# EAGLE design ThermoEagle (EAGLE 9.3.1)
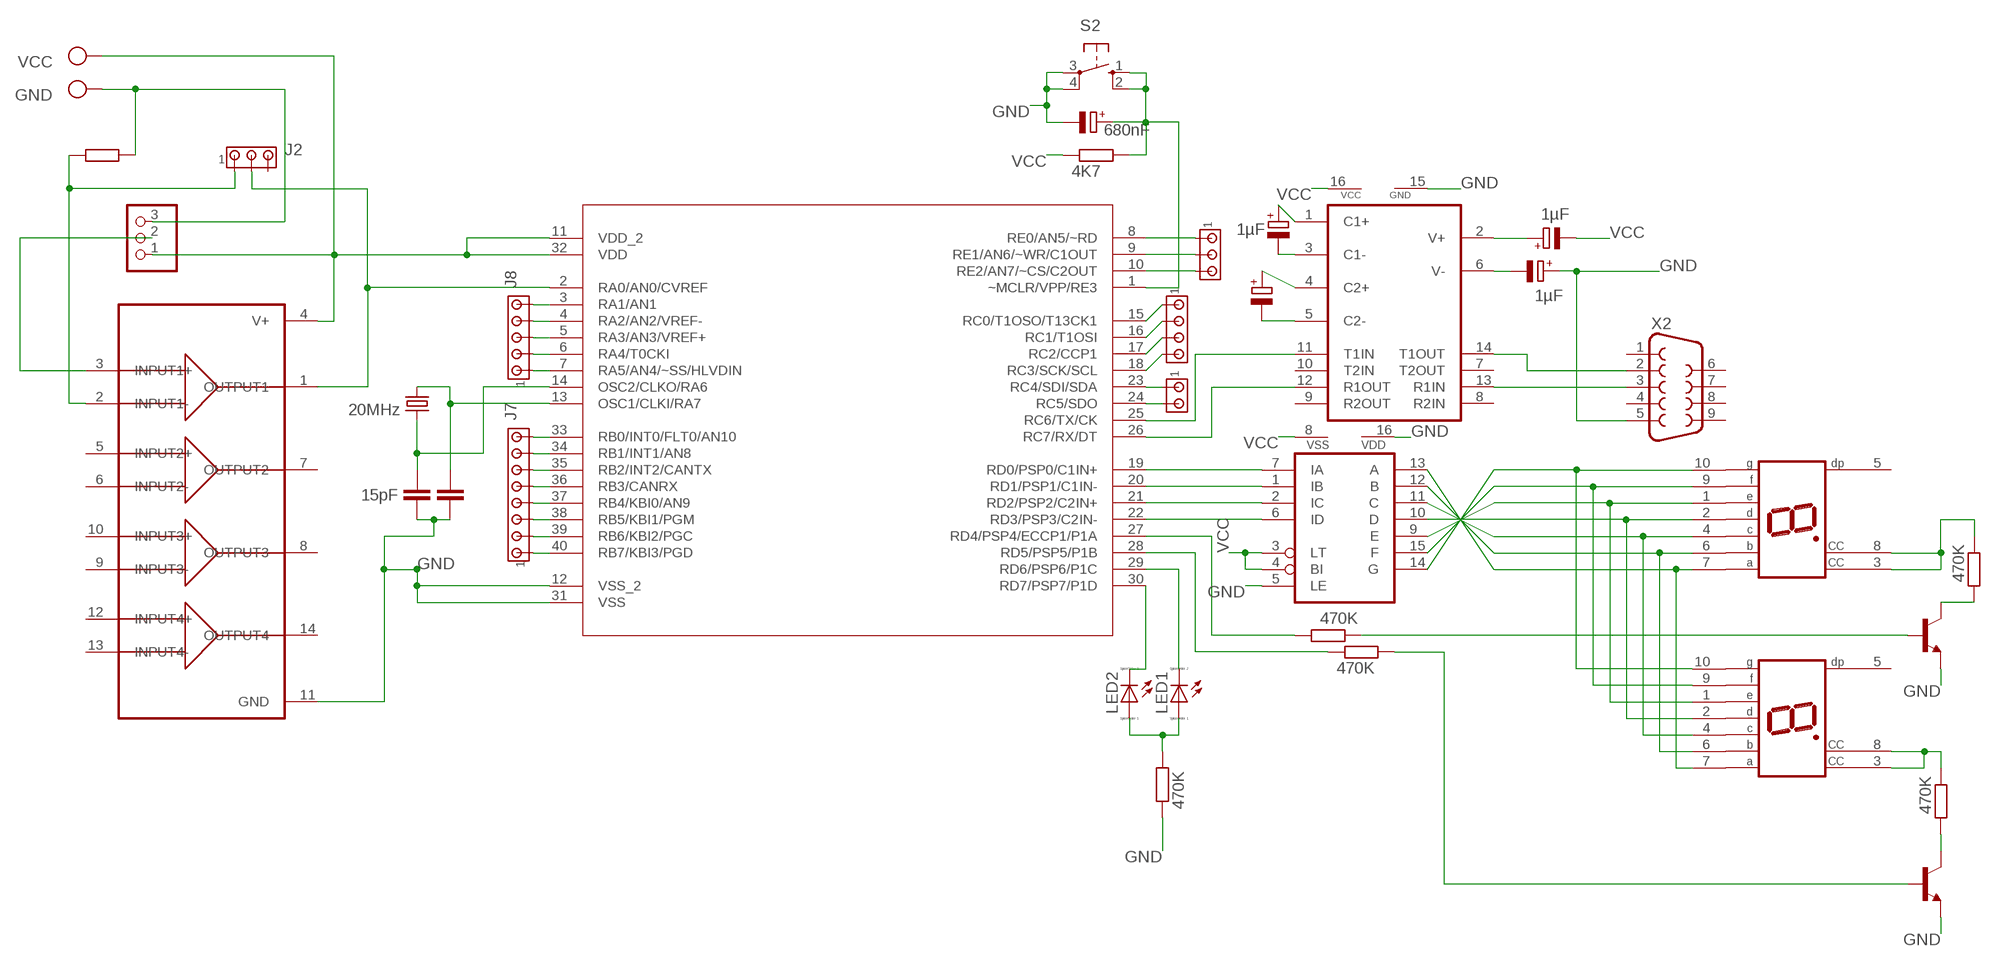
[diagram p0: schematic, sheet 1]

## Parts
C1  1µF  CPOL-EUB45181B  [B45181B]
C2  1µF  CPOL-EUB45181B  [B45181B]
C3  1µF  CPOL-EUB45181B  [B45181B]
C5  1µF  CPOL-EUB45181B  [B45181B]
C6  15pF  C-EU050-025X075  [C050-025X075]
C7  C-EU050-025X075  [C050-025X075]
C8  680nF  CPOL-EUB45181C  [B45181C]
DIS1  HD-H103  [HDSP-M]
DIS2  HD-H103  [HDSP-M]
IC1  MAX232  [DIL16]
IC2  4511N  [DIL16]
J1  MTA04-100  [10X04MTA]
J2  MTA03-100  [10X03MTA]
J3  MTA02-100  [10X02MTA]
J4  MTA03-100  [10X03MTA]
J7  MTA08-100  [10X08MTA]
J8  MTA05-100  [10X05MTA]
JP1  PINHD-1X3  [1X03]
LED1  LED_ELD260  [LED_LD260]
LED2  LED_ELD260  [LED_LD260]
Q1  20MHz  CRYSTALHC18U-V  [HC18U-V]
R1  470K  R-EU_0207/7  [0207/7]
R2  470K  R-EU_0207/7  [0207/7]
R3  470K  R-EU_0207/7  [0207/7]
R10  470K  R-EU_0207/7  [0207/7]
R11  470K  R-EU_0207/7  [0207/7]
R13  R-EU_0207/7  [0207/7]
R14  4K7  R-EU_0207/7  [0207/7]
S2  10-XX  [B3F-10XX]
T1  2N2219  [TO5]
T2  2N2219  [TO5]
U1  LM324  [DIP790W51P254L1994H508Q14]
U$1  PIC18F4585-I/P  [DIP254P1524X635-40]
X1  AK300/2  [AK300/2]
X2  F09VB  [F09VB]

## Nets
GND: C3.+ C6.2 C7.2 C8.- IC1.15(GND) IC2.5(LE) IC2.16(VDD) JP1.3 R1.1 R13.1 S2.3(P) S2.4(P1) T1.1(E) T2.1(E) U1.11(GND) U$1.12(VSS_2) U$1.31(VSS) X1.2 X2.5
N$1: IC2.7(IA) U$1.19(RD0/PSP0/C1IN+)
N$2: IC1.14(T1OUT) X2.2
N$3: R11.2 T1.2(B)
N$4: R10.2 T2.2(B)
N$6: IC2.1(IB) U$1.20(RD1/PSP1/C1IN-)
N$7: DIS1.3(CC) DIS1.8(CC) R3.1
N$9: R2.2 T1.3(C)
N$10: DIS1.9(F) DIS2.9(F) IC2.15(F)
N$11: IC2.2(IC) U$1.21(RD2/PSP2/C2IN+)
N$12: DIS2.3(CC) DIS2.8(CC) R2.1
N$13: C1.+ IC1.1(C1+)
N$14: C1.- IC1.3(C1-)
N$15: C5.+ IC1.4(C2+)
N$16: C5.- IC1.5(C2-)
N$17: C2.+ IC1.2(V+)
N$19: C3.- IC1.6(V-)
N$21: IC1.13(R1IN) X2.3
N$22: IC2.6(ID) U$1.22(RD3/PSP3/C2IN-)
N$23: LED1.A LED2.A R1.2
N$24: DIS1.1(E) DIS2.1(E) IC2.9(E)
N$25: DIS1.2(D) DIS2.2(D) IC2.10(D)
N$26: DIS1.4(C) DIS2.4(C) IC2.11(C)
N$27: DIS1.6(B) DIS2.6(B) IC2.12(B)
N$28: DIS1.7(A) DIS2.7(A) IC2.13(A)
N$30: R3.2 T2.3(C)
N$31: J2.1 R13.2 U1.2(INPUT1-)
N$32: J8.5 U$1.3(RA1/AN1)
N$33: J8.4 U$1.4(RA2/AN2/VREF-)
N$34: J8.3 U$1.5(RA3/AN3/VREF+)
N$35: J8.2 U$1.6(RA4/T0CKI)
N$36: DIS1.10(G) DIS2.10(G) IC2.14(G)
N$37: LED2.K(C) U$1.30(RD7/PSP7/P1D)
N$38: R10.1 U$1.27(RD4/PSP4/ECCP1/P1A)
N$41: IC1.11(T1IN) U$1.25(RC6/TX/CK)
N$44: R11.1 U$1.28(RD5/PSP5/P1B)
N$45: LED1.K(C) U$1.29(RD6/PSP6/P1C)
N$47: J8.1 U$1.7(RA5/AN4/~SS/HLVDIN)
N$48: JP1.2 U1.3(INPUT1+)
N$49: J2.2 U1.1(OUTPUT1) U$1.2(RA0/AN0/CVREF)
N$50: J7.8 U$1.33(RB0/INT0/FLT0/AN10)
N$51: J7.7 U$1.34(RB1/INT1/AN8)
N$52: C6.1 Q1.1 U$1.14(OSC2/CLKO/RA6)
N$53: C7.1 Q1.2 U$1.13(OSC1/CLKI/RA7)
N$54: J7.6 U$1.35(RB2/INT2/CANTX)
N$58: J7.5 U$1.36(RB3/CANRX)
N$59: J7.4 U$1.37(RB4/KBI0/AN9)
N$60: J7.3 U$1.38(RB5/KBI1/PGM)
N$61: J7.2 U$1.39(RB6/KBI2/PGC)
N$62: J7.1 U$1.40(RB7/KBI3/PGD)
N$63: J4.1 U$1.8(RE0/AN5/~RD)
N$64: J4.2 U$1.9(RE1/AN6/~WR/C1OUT)
N$65: J4.3 U$1.10(RE2/AN7/~CS/C2OUT)
N$66: J1.1 U$1.15(RC0/T1OSO/T13CK1)
N$67: J1.2 U$1.16(RC1/T1OSI)
N$68: J1.3 U$1.17(RC2/CCP1)
N$69: J1.4 U$1.18(RC3/SCK/SCL)
N$70: J3.1 U$1.23(RC4/SDI/SDA)
N$71: J3.2 U$1.24(RC5/SDO)
N$72: C8.+ R14.2 S2.1(S) S2.2(S1) U$1.1(~MCLR/VPP/RE3)
RX: IC1.12(R1OUT) U$1.26(RC7/RX/DT)
VCC: C2.- IC1.16(VCC) IC2.3(LT) IC2.4(BI) IC2.8(VSS) JP1.1 R14.1 U1.4(V+) U$1.11(VDD_2) U$1.32(VDD) X1.1
Unconnected: DIS1.5(DP) DIS2.5(DP) IC1.7(T2OUT) IC1.8(R2IN) IC1.9(R2OUT) IC1.10(T2IN) J2.3 U1.5(INPUT2+) U1.6(INPUT2-) U1.7(OUTPUT2) U1.8(OUTPUT3) U1.9(INPUT3-) U1.10(INPUT3+) U1.12(INPUT4+) U1.13(INPUT4-) U1.14(OUTPUT4) X2.1 X2.4 X2.6 X2.7 X2.8 X2.9

## Library data of the parts
C1-C3 C5 C8 = rcl:CPOL-EU: POLARIZED CAPACITOR, European symbol; SPICEPREFIX: C
C6 C7 = rcl:C-EU: CAPACITOR, European symbol; SPICEPREFIX: C
DIS1 DIS2 = display-hp:HD-H103: LED DISPLAY 1-character 7 segment, decimal point right; OC_FARNELL: unknown; OC_NEWARK: unknown
IC1 = maxim:MAX232: RS232 TRANSCEIVER; MF: MAXIM; MPN: MAX232ACPE+; OC_FARNELL: 9723773; OC_NEWARK: 68K4544
IC2 = 45xx:4511: BCD to 7-segment LATCH/DECODER/DRIVER
J1 = con-amp:MTA04-100: AMP connector
J2 J4 = con-amp:MTA03-100: AMP connector
J3 = con-amp:MTA02-100: AMP connector
J7 = con-amp:MTA08-100: AMP connector
J8 = con-amp:MTA05-100: AMP connector
JP1 = adafruit:PINHD-1X3: PIN HEADER
LED1 LED2 = eagle-ltspice:LED_E: LED Source: http://www.osram.convergy.de Source: www.luxeon.com Source: www.kingbright.com; SPICEMODEL: NONE; SPICEPREFIX: D; SPICETYPE: diode
Q1 = crystal:CRYSTAL: CRYSTAL; OC_FARNELL: unknown; OC_NEWARK: unknown
R1-R3 R10 R11 R13 R14 = resistor:R-EU_: RESISTOR, European symbol
S2 = DC_LOAD_AU:10-XX: OMRON SWITCH; MPN: B3F-1000; OC_FARNELL: 176432; OC_NEWARK: 36M3542
T1 T2 = transistor:2N2219: NPN TRANSISTOR
U1 = LM324:LM324: these devices consist of four independent high-gain frequency-compensated operational amplifiers that are designed sp...; AVAILABILITY: Unavailable; DESCRIPTION: these devices consist of four independent high-gain frequency-compensated operational amplifiers that are designed sp...; MF: STMicroelectronics; MP: LM324; PACKAGE: SOIC-14 Texas Instruments; PRICE: None
U$1 = PIC18F4585-I_P:PIC18F4585-I/P: Enhanced Flash Microcontrollers; DESCRIPTION: PIC18F4585-I/P, 8bit PIC Microcontroller, 40MHz, 48kb, 1024 B Flash, 40-Pin PDIP; DIGI-KEY_PART_NUMBER: PIC18F4585-I/P-ND; DIGI-KEY_PURCHASE_URL: https://www.digikey.com/product-detail/en/microchip-technology/PIC18F4585-I-P/PIC18F4585-I-P-ND/613250?utm_source=snapeda&utm_medium=aggregator&utm_campaign=symbol; MF: Microchip; MP: PIC18F4585-I/P; PACKAGE: DIP-40 Microchip
X1 = con-ptr500:AK300/2: CONNECTOR; OC_FARNELL: unknown; OC_NEWARK: unknown
X2 = con-subd:F09: SUB-D; OC_FARNELL: unknown; OC_NEWARK: unknown

## Board
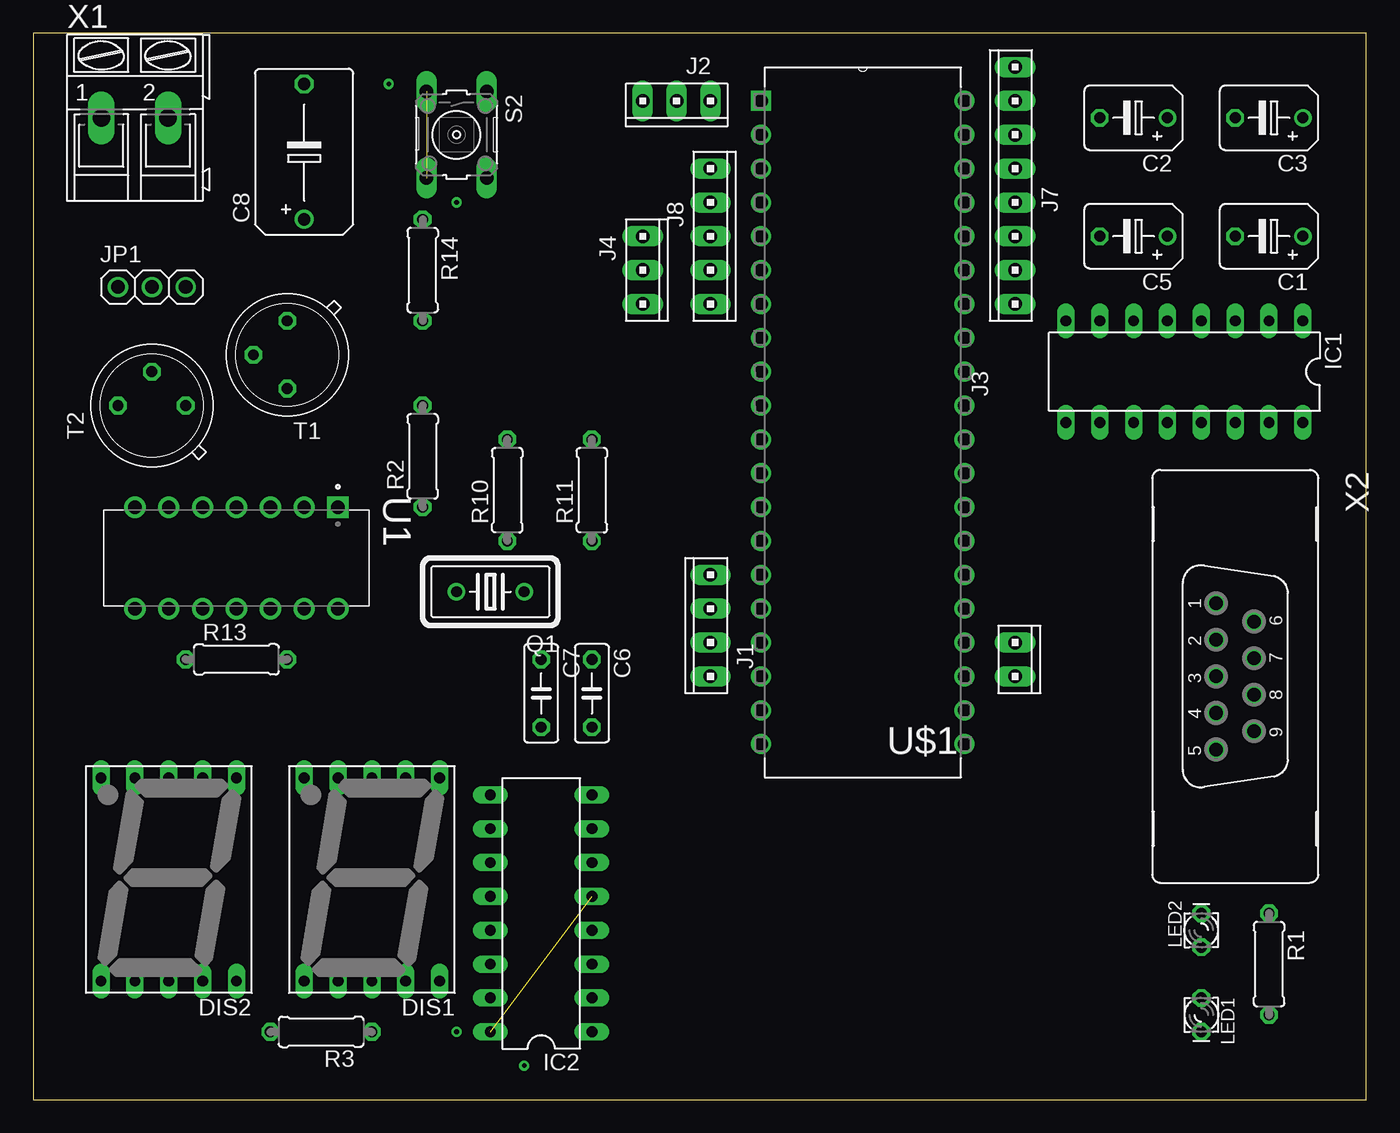
[diagram p1: board, top side]
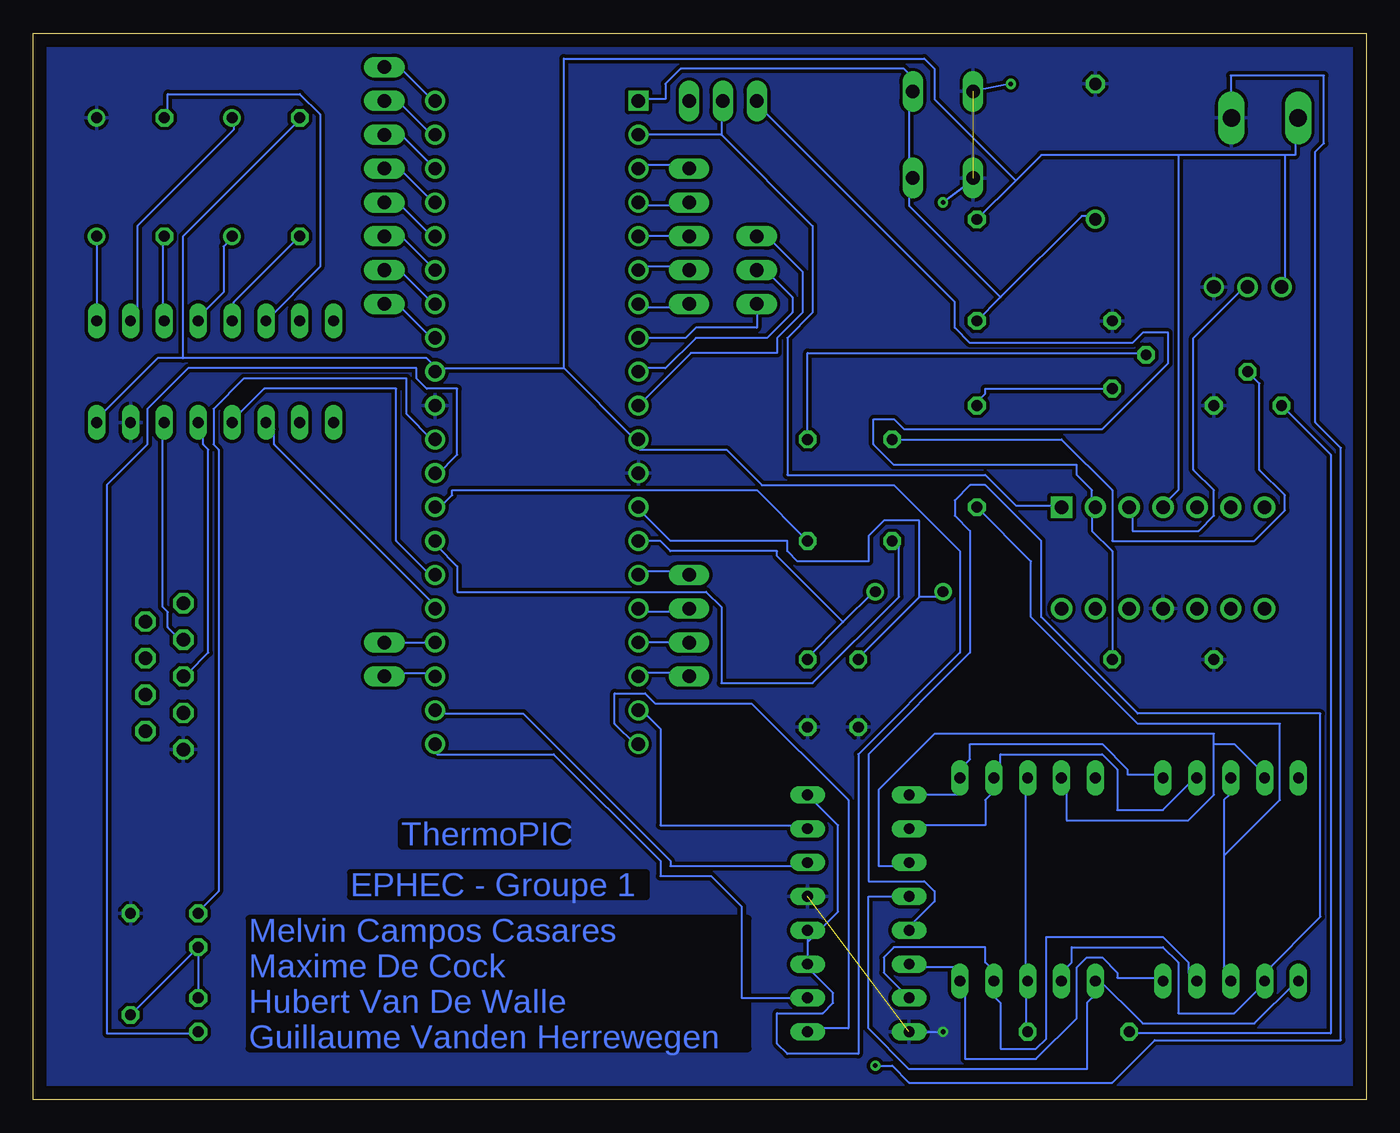
[diagram p2: board, bottom side, seen from below]

Size 100 x 80 mm. Coordinates in mm from the lower left corner, seen from the top.
Outline: 0,0 100,0 100,80 0,80 0,0
Copper layers (1*16): Top 0.035mm / dielectric 1.5mm / Bottom 0.035mm
Design rules "default *": minimum track width 6mil, minimum drill 0.35mm, track to track 10mil, track to pad 15mil, pad to pad 15mil, via to via 15mil, smd to smd 6mil, copper to edge 40mil, drill to drill 6mil, minimum pad ring 10mil, minimum via ring 8mil, stop-mask expansion 4mil, vias tented up to drill 0mil, thermal gap 10mil

### Footprints (pad centres in the part's own frame; a part is rotated, then mirrored left to right if it is on the bottom)
B45181B = drill 0.813: + -2.54,0 | drill 0.813 octagon: - 2.54,0
C050-025X075 = drill 0.813 octagon: 1 -2.54,0; 2 2.54,0
B45181C = drill 0.914: + -5.08,0 | drill 0.914 octagon: - 5.08,0
HDSP-M = drill 0.813 long: 1 -5.08,-7.62; 2 -2.54,-7.62; 3 0,-7.62; 4 2.54,-7.62; 5 5.08,-7.62; 6 5.08,7.62; 7 2.54,7.62; 8 0,7.62; 9 -2.54,7.62; 10 -5.08,7.62
DIL16 = drill 0.813 long: 1 -8.89,-3.81; 2 -6.35,-3.81; 3 -3.81,-3.81; 4 -1.27,-3.81; 5 1.27,-3.81; 6 3.81,-3.81; 7 6.35,-3.81; 8 8.89,-3.81; 9 8.89,3.81; 10 6.35,3.81; 11 3.81,3.81; 12 1.27,3.81; 13 -1.27,3.81; 14 -3.81,3.81; 15 -6.35,3.81; 16 -8.89,3.81
10X04MTA = drill 1.016 long: 1 3.81,0; 2 1.27,0; 3 -1.27,0; 4 -3.81,0
10X03MTA = drill 1.016 long: 1 2.54,0; 2 0,0; 3 -2.54,0
10X02MTA = drill 1.016 long: 1 1.27,0; 2 -1.27,0
10X08MTA = drill 1.016 long: 1 8.89,0; 2 6.35,0; 3 3.81,0; 4 1.27,0; 5 -1.27,0; 6 -3.81,0; 7 -6.35,0; 8 -8.89,0
10X05MTA = drill 1.016 long: 1 5.08,0; 2 2.54,0; 3 0,0; 4 -2.54,0; 5 -5.08,0
1X03 = drill 1.016: 1 -2.54,0; 2 0,0; 3 2.54,0
LED_LD260 = drill 0.813 octagon: A -1.27,0; K 1.27,0
HC18U-V = drill 0.813: 1 -2.54,0; 2 2.54,0
0207/7 = drill 0.813 octagon: 1 -3.81,0; 2 3.81,0
B3F-10XX = drill 1.016 long: 1 -3.251,2.261; 2 3.251,2.261; 3 -3.251,-2.261; 4 3.251,-2.261
TO5 = drill 0.813 octagon: 1 0,-2.54; 2 2.54,0; 3 0,2.54
DIP790W51P254L1994H508Q14 = drill 1 pad 1.6 square: 1 -3.81,7.62 | drill 1 pad 1.6: 2 -3.81,5.08; 3 -3.81,2.54; 4 -3.81,0; 5 -3.81,-2.54; 6 -3.81,-5.08; 7 -3.81,-7.62; 8 3.81,-7.62; 9 3.81,-5.08; 10 3.81,-2.54; 11 3.81,0; 12 3.81,2.54; 13 3.81,5.08; 14 3.81,7.62
DIP254P1524X635-40 = drill 0.991 square: 1 -15.24,48.26 | drill 0.991: 2 -15.24,45.72; 3 -15.24,43.18; 4 -15.24,40.64; 5 -15.24,38.1; 6 -15.24,35.56; 7 -15.24,33.02; 8 -15.24,30.48; 9 -15.24,27.94; 10 -15.24,25.4; 11 -15.24,22.86; 12 -15.24,20.32; 13 -15.24,17.78; 14 -15.24,15.24; 15 -15.24,12.7; 16 -15.24,10.16; 17 -15.24,7.62; 18 -15.24,5.08; 19 -15.24,2.54; 20 -15.24,0; 21 0,0; 22 0,2.54; 23 0,5.08; 24 0,7.62; 25 0,10.16; 26 0,12.7; 27 0,15.24; 28 0,17.78; 29 0,20.32; 30 0,22.86; 31 0,25.4; 32 0,27.94; 33 0,30.48; 34 0,33.02; 35 0,35.56; 36 0,38.1; 37 0,40.64; 38 0,43.18; 39 0,45.72; 40 0,48.26
AK300/2 = drill 1.321 long: 1 -2.515,0; 2 2.489,0
F09VB = drill 1.016 octagon: 1 -5.486,-1.422; 2 -2.743,-1.422; 3 0,-1.422; 4 2.743,-1.422; 5 5.486,-1.422; 6 -4.115,1.422; 7 -1.372,1.422; 8 1.372,1.422; 9 4.115,1.422

### Placement (x,y rotation side)
C1  92.71,64.77 180 top
C2  82.55,73.66 180 top
C3  92.71,73.66 180 top
C5  82.55,64.77 180 top
C6  41.91,30.48 270 top
C7  38.1,30.48 270 top
C8  20.32,71.12 90 top
DIS1  25.4,16.51 180 top
DIS2  10.16,16.51 180 top
IC1  86.36,54.61 180 top
IC2  38.1,13.97 90 top
J1  50.8,35.56 90 top
J2  48.26,74.93 180 top
J3  73.66,33.02 270 top
J4  45.72,62.23 270 top
J7  73.66,68.58 90 top
J8  50.8,64.77 270 top
JP1  8.89,60.96 0 top
LED1  87.63,6.35 270 top
LED2  87.63,12.7 90 top
Q1  34.29,38.1 180 top
R1  92.71,10.16 270 top
R2  29.21,48.26 90 top
R3  21.59,5.08 180 top
R10  35.56,45.72 90 top
R11  41.91,45.72 90 top
R13  15.24,33.02 0 top
R14  29.21,62.23 270 top
S2  31.75,72.39 270 top
T1  19.05,55.88 180 top
T2  8.89,52.07 90 top
U1  15.24,40.64 270 top
U$1  69.85,26.67 0 top
X1  7.62,73.66 0 top
X2  90.17,31.75 270 top

### Tracks (layer width: path | path; a pad name or v marks a point on that pad's centre or on a via)
GND  (via drill 0.35)  (2 unrouted)
  Bottom 0.152: IC2.16 v31.75,5.08
  pour Bottom (isolate 0.025): 0,80.01 100.33,80.01 100.33,0 0,0
N$1
  Bottom 0.152: IC2.7 41.91,20.57 52.96,20.57 52.96,27.81 54.48,29.34 U$1.19
N$2
  Bottom 0.152: IC1.14 90.3,50.67 90.3,36.96 89.92,36.58 89.92,35.43 88.77,34.29 X2.2
N$3
  Bottom 0.152: R11.2 41.91,56.01 16.76,56.01 T1.2
N$4
  Bottom 0.152: T2.2 8,53.72 8,47.24 6.1,45.34 6.1,44.2 8.38,41.91 19.05,41.91 19.05,45.72 22.86,49.53 R10.2
N$5  (via drill 0.35)
  Bottom 0.152: 29.21,69.22 v31.75,67.31
N$6
  Bottom 0.152: IC2.1 41.91,5.33 38.86,5.33 38.86,22.48 46.1,29.72 53.34,29.72 54.1,30.48 56.39,30.48 56.39,28.19 54.86,26.67 U$1.20
N$7
  Bottom 0.152: R3.1 25.53,5.33 25.53,8.76 DIS1.8 25.53,9.14 25.53,24 DIS1.3
N$8  (via drill 0.35)
  Bottom 0.152: v36.83,2.54 35.56,2.54 34.29,1.27 19.05,1.27 15.88,4.45 1.91,4.45 1.91,48.9 3.81,50.8 3.81,71.12 3.17,71.75 3.17,76.83 10.16,76.83 10.16,73.66
N$9
  Bottom 0.152: T1.3 28.57,53.34 28.57,52.96 28.96,52.58 28.96,52.2 R2.2
N$10
  Bottom 0.152: IC2.15 36.2,9.53 36.2,10.67 35.43,11.43 28.57,11.43 28.57,10.29 28.19,9.91 28.19,9.14 DIS1.9 27.81,8.76 27.81,7.62 27.43,7.24 27.43,3.81 24.77,3.81 24,4.57 24,12.19 15.24,12.19 13.34,10.29 13.34,9.53 DIS2.9
N$11
  Bottom 0.152: IC2.2 46.86,7.62 46.86,14.48 49.15,16.76 52.96,16.76 52.96,17.91 60.96,25.91 69.72,25.91 69.72,26.67 U$1.21
N$12
  Bottom 0.152: 10.67,18.29 10.67,22.48 10.29,22.86 10.29,24 DIS2.3 | 10.67,18.29 10.67,9.53 10.29,9.14 DIS2.8 | R2.1 25.15,40.39 25.15,36.2 17.14,28.19 6.48,28.19 6.48,22.48 10.67,18.29
N$13
  Bottom 0.152: C1.+ IC1.1
N$14
  Bottom 0.152: IC1.3 90.3,58.67 90.3,64.77 C1.-
N$15
  Bottom 0.152: IC1.4 87.63,58.67 85.72,60.58 85.72,64.01 85.34,64.39 85.34,64.77 C5.+
N$16
  Bottom 0.152: C5.- 84.96,59.82 84.96,58.67 IC1.5
N$17
  Bottom 0.152: IC1.2 92.58,58.67 92.2,59.05 92.2,65.53 84.96,72.77 84.96,73.53 C2.+
N$18  (via drill 0.35)
  Bottom 0.152: v26.67,76.2 29.84,75.56
N$19
  Bottom 0.152: IC1.6 78.49,62.48 78.49,73.91 80.01,75.44 89.92,75.44 89.92,73.91 C3.-
N$21
  Bottom 0.152: IC1.13 87.63,50.67 87.25,50.29 87.25,49.15 86.87,48.77 86.87,33.53 88.39,32 X2.3
N$22
  Bottom 0.152: IC2.6 41.91,17.53 52.2,17.53 52.2,17.91 63.25,28.96 69.72,28.96 U$1.22
N$23
  Bottom 0.152: LED1.A LED2.A R1.2
N$24
  Bottom 0.152: DIS2.1 15.24,24.38 17.91,24.38 17.91,24.77 19.81,26.67 29.72,26.67 29.72,25.53 30.48,24.77 DIS1.1 30.48,22.86 IC2.9
N$25
  Bottom 0.152: DIS2.2 12.95,24 15.24,21.72 18.67,21.72 18.67,24.77 19.81,25.91 27.43,25.91 27.43,24.77 27.81,24.38 DIS1.2 28.19,24 28.19,22.86 28.57,22.48 28.57,20.57 34.29,20.57 IC2.10
N$26
  Bottom 0.152: 11.43,26.67 9.91,26.67 7.62,24.38 DIS2.4 | 11.43,26.67 11.43,22.86 13.34,20.95 22.48,20.95 22.48,23.62 22.86,24 DIS1.4 | 11.43,26.67 11.43,27.43 32.38,27.43 36.58,23.24 36.58,17.53 34.29,17.53 IC2.11
N$27
  Bottom 0.152: DIS2.6 5.33,8.76 8.38,5.71 16.76,5.71 20.19,9.14 DIS1.6 20.57,8.76 20.57,7.62 20.95,7.24 20.95,2.29 34.29,2.29 37.34,5.33 37.34,15.24 IC2.12
N$28
  Bottom 0.152: DIS1.7 22.86,9.53 22.1,10.29 22.1,11.43 15.24,11.43 14.1,10.29 14.1,6.48 9.91,6.48 7.62,8.76 DIS2.7 7.62,9.53 3.43,13.72 3.43,28.96 17.14,28.96 24.38,36.2 24.38,41.91 28.57,46.1 29.72,46.1 30.86,44.96 30.86,43.81 29.72,42.67 29.72,33.53 37.34,25.91 37.34,16.38 33.15,16.38 32.38,15.62 32.38,14.86 34.29,12.95 IC2.13
N$30
  Bottom 0.152: T2.3 2.67,48.39 2.67,4.95 17.53,4.95 R3.2
N$31
  Bottom 0.152: R13.2 19.05,41.15 20.57,42.67 20.57,44.2 U1.2 20.57,44.58 20.57,45.72 21.72,46.86 21.72,47.62 35.43,47.62 36.96,49.15 36.96,51.05 35.43,51.05 34.67,50.29 19.81,50.29 14.86,55.24 14.86,57.53 16.76,57.53 17.53,56.77 29.72,56.77 30.86,57.91 30.86,59.82 45.72,74.68 J2.1
N$32
  Bottom 0.152: U$1.3 54.48,70.1 51.05,70.1 J8.5
N$33
  Bottom 0.152: U$1.4 54.48,67.06 51.05,67.06 J8.4
N$34
  Bottom 0.152: J8.3 U$1.5
N$35
  Bottom 0.152: U$1.6 54.48,62.48 51.05,62.48 J8.2
N$36
  Bottom 0.152: DIS2.10 15.24,9.14 18.67,9.14 18.67,9.53 19.81,10.67 20.95,10.67 21.72,9.91 21.72,6.1 24.77,3.05 30.1,3.05 30.1,8.38 30.48,8.76 DIS1.10 30.48,9.91 34.29,9.91 IC2.14
N$37
  Bottom 0.152: LED2.K 87.63,14.1 86.11,15.62 86.11,48.77 86.49,49.15 86.49,51.82 84.2,54.1 72.01,54.1 72.01,51.44 70.1,49.53 U$1.30
N$38
  Bottom 0.152: R10.1 35.43,41.91 35.05,41.53 35.05,37.72 41.53,31.24 48.39,31.24 48.39,36.96 49.53,38.1 68.2,38.1 68.2,40.01 69.72,41.53 69.72,41.91 U$1.27
N$41
  Bottom 0.152: IC1.11 82.3,50.67 81.92,50.29 81.92,49.15 70.1,37.34 70.1,36.96 U$1.25
N$44
  Bottom 0.152: R11.1 45.72,45.72 68.58,45.72 68.58,45.34 69.72,44.2 U$1.28
N$45
  Bottom 0.152: LED1.K 87.63,4.95 94.49,4.95 94.49,46.1 91.44,49.15 91.44,51.82 88.39,54.86 71.25,54.86 71.25,54.1 70.48,53.34 68.2,53.34 68.2,48.39 69.72,46.86 U$1.29
N$47
  Bottom 0.152: U$1.7 54.48,59.44 51.05,59.44 J8.1
N$48
  Bottom 0.152: JP1.2 9.14,60.96 12.95,57.15 12.95,47.24 11.43,45.72 11.43,43.81 12.57,42.67 17.53,42.67 17.53,44.2 U1.3
N$49
  Bottom 0.152: 48.39,72.39 U$1.2 | 48.39,72.39 48.39,74.68 J2.2 | 48.39,72.39 41.53,65.53 41.53,59.05 43.43,57.15 43.43,46.86 28.57,46.86 26.29,44.58 22.86,44.58 U1.1
N$50
  Bottom 0.152: U$1.33 70.1,57.15 72.39,59.44 73.53,59.44 J7.8
N$51
  Bottom 0.152: U$1.34 70.1,59.82 72.39,62.1 73.53,62.1 J7.7
N$52
  Bottom 0.152: 39.24,35.81 36.96,38.1 Q1.1 | 39.24,35.81 41.91,33.15 C6.1 | U$1.14 52.96,41.91 52.2,41.15 44.2,41.15 44.2,40.77 39.24,35.81
N$53
  Bottom 0.152: 33.53,37.72 38.1,33.15 C7.1 | 33.53,37.72 32,37.72 32,38.1 Q1.2 | 33.53,37.72 33.53,43.43 36.2,43.43 37.34,42.29 37.34,40.39 42.67,40.39 43.43,41.15 43.43,41.91 52.2,41.91 54.48,44.2 U$1.13
N$54
  Bottom 0.152: U$1.35 72.39,64.77 J7.6
N$58
  Bottom 0.152: U$1.36 70.1,64.77 72.39,67.06 73.53,67.06 J7.5
N$59
  Bottom 0.152: U$1.37 70.1,67.44 72.39,69.72 73.53,69.72 J7.4
N$60
  Bottom 0.152: U$1.38 72.39,72.39 J7.3
N$61
  Bottom 0.152: U$1.39 70.1,72.39 72.39,74.68 73.53,74.68 J7.2
N$62
  Bottom 0.152: U$1.40 70.1,75.06 72.39,77.34 73.53,77.34 J7.1
N$63
  Bottom 0.152: U$1.8 51.05,57.15 50.29,57.91 45.72,57.91 J4.1
N$64
  Bottom 0.152: U$1.9 54.48,54.86 52.58,54.86 50.29,57.15 44.96,57.15 43.05,59.05 43.05,60.2 44.96,62.1 45.72,62.1 J4.2
N$65
  Bottom 0.152: U$1.10 50.67,56.01 44.2,56.01 44.2,57.15 42.29,59.05 42.29,62.1 44.96,64.77 J4.3
N$66
  Bottom 0.152: U$1.15 54.48,39.62 51.05,39.62 J1.1
N$67
  Bottom 0.152: U$1.16 54.48,36.58 51.05,36.58 J1.2
N$68
  Bottom 0.152: J1.3 U$1.17
N$69
  Bottom 0.152: U$1.18 54.48,32 51.05,32 J1.4
N$70
  Bottom 0.152: U$1.23 70.1,32 73.53,32 J3.1
N$71
  Bottom 0.152: J3.2 U$1.24
N$72
  Bottom 0.152: 27.43,60.2 21.34,66.29 20.57,66.29 C8.+ | 27.43,60.2 R14.2 | U$1.1 54.48,75.06 52.58,75.06 52.58,76.2 51.44,77.34 34.67,77.34 34.29,76.96 34.29,75.82 S2.1 34.29,75.44 34.29,69.34 S2.2 34.29,68.96 34.29,67.06 27.43,60.2
RX
  Bottom 0.152: IC1.12 84.96,51.05 82.68,53.34 72.77,53.34 72.77,41.91 70.1,39.24 U$1.26
VCC
  Bottom 0.152: 26.29,68.96 24.38,70.87 14.1,70.87 | 26.29,68.96 R14.1 | 6.1,70.87 5.33,70.87 5.33,73.53 X1.1 | 6.1,70.87 14.1,70.87 | 6.1,70.87 6.1,60.96 JP1.1 | 14.1,70.87 14.1,45.72 15.24,44.58 U1.4 | IC2.4 41.91,11.81 | 41.91,11.81 IC2.3 41.91,9.91 40.01,8 40.01,7.24 40.77,6.48 44.2,6.48 44.2,4.19 43.43,3.43 38.1,3.43 38.1,25.91 30.48,33.53 30.48,41.15 35.43,46.1 45.34,46.1 48.01,48.77 54.48,48.77 54.48,49.53 U$1.11 54.86,49.53 60.2,54.86 | IC2.8 39.62,20.57 39.62,14.1 41.91,11.81 | 88.77,55.63 70.48,55.63 70.1,55.24 70.1,54.86 U$1.32 69.72,54.86 60.2,54.86 | 88.77,55.63 90.68,55.63 95.25,51.05 IC1.16 | 88.77,55.63 88.77,64.77 80.01,73.53 C2.- | 26.29,68.96 32.38,75.06 32.38,77.34 33.15,78.11 60.2,78.11 60.2,54.86

### Text on the board
Bottom: ThermoPIC | EPHEC - Groupe 1 | Melvin Campos Casares / Maxime De Cock / Hubert Van De Walle / Guillaume Vanden Herrewegen